# EAGLE design MarioCube_v1.1 (EAGLE 6.2)
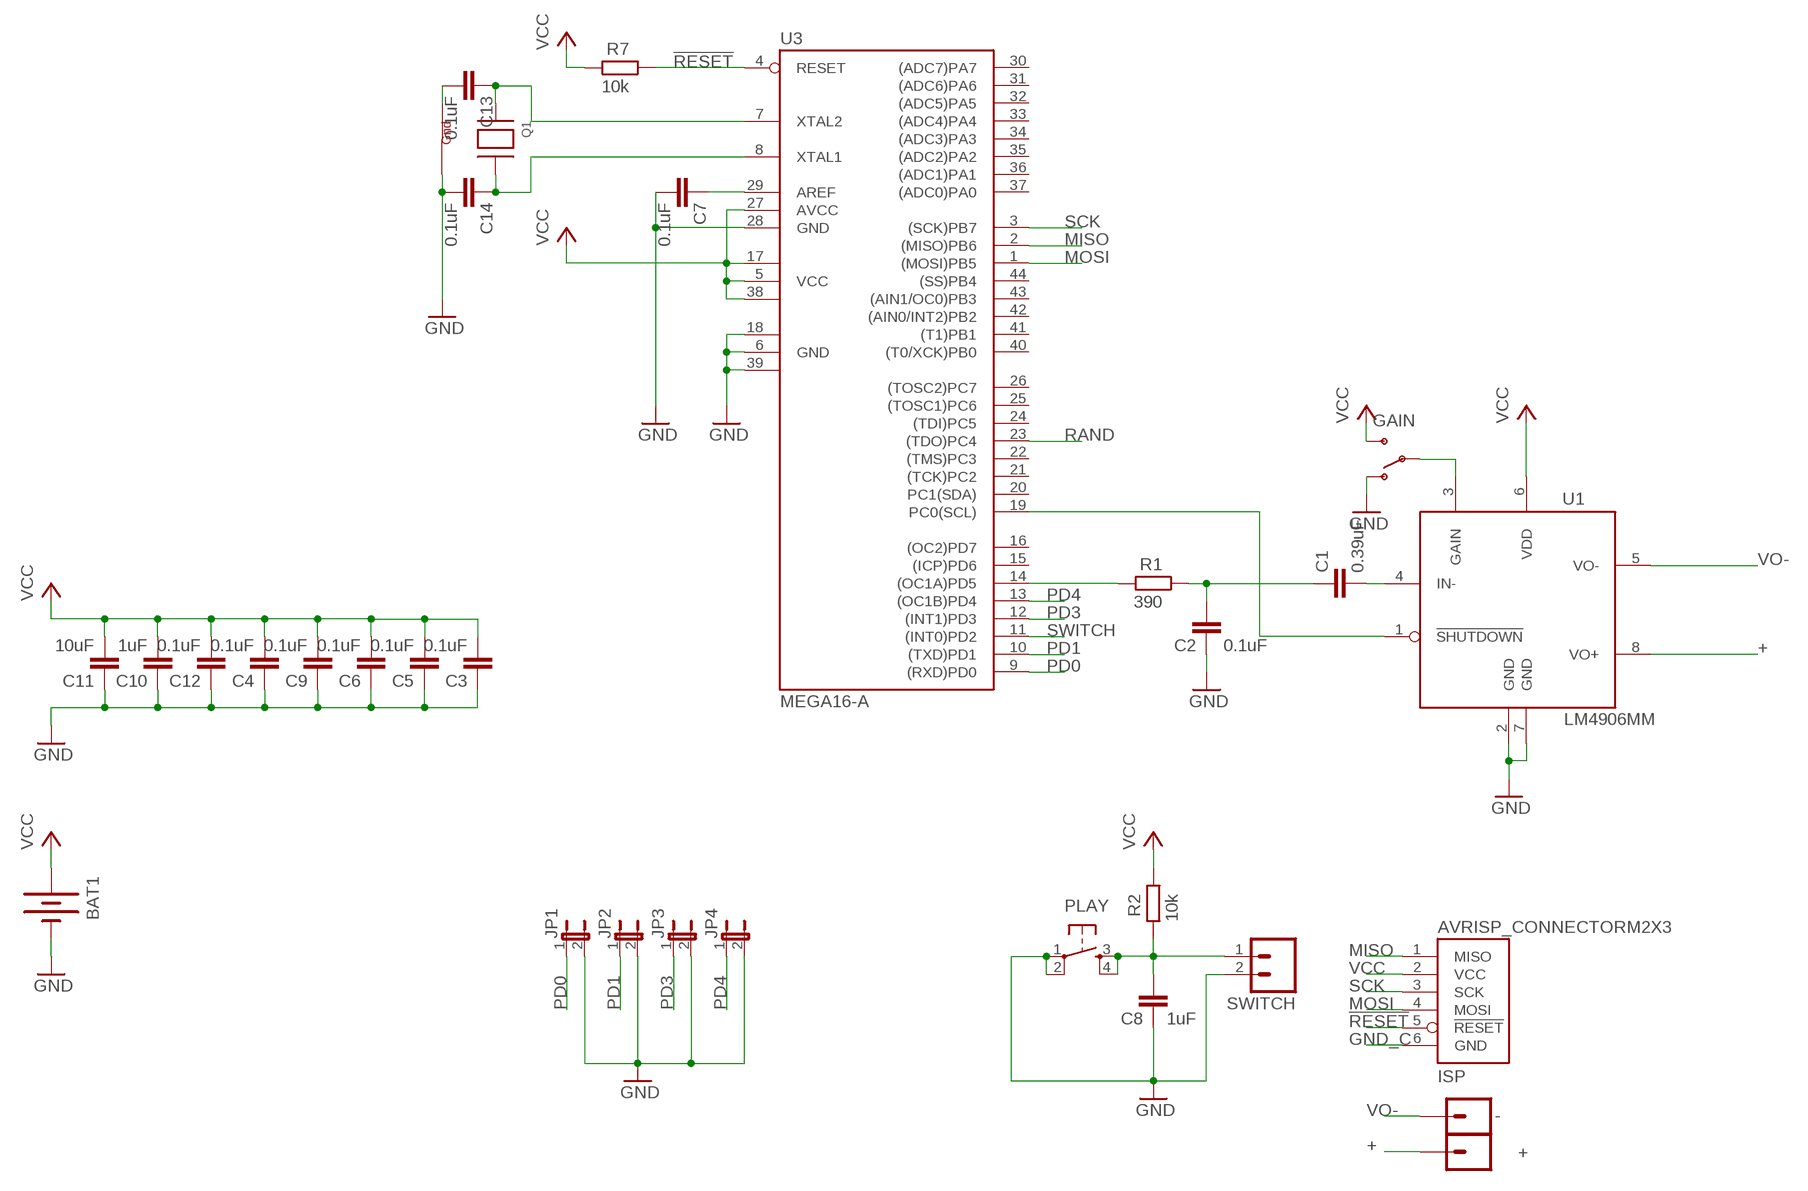
[diagram p0: schematic, sheet 1]

## Parts
+  M01OFFSET  [1X01_OFFSET]
-  M01OFFSET  [1X01_OFFSET]
BAT1  BATTERY2XAAA-2468  [BATTERY_HOLDER_2468]
C1  0.39uF  C-EUC0603K  [C0603K]
C2  0.1uF  C-EUC0603K  [C0603K]
C3  0.1uF  C-EUC0603K  [C0603K]
C4  0.1uF  C-EUC0603K  [C0603K]
C5  0.1uF  C-EUC0603K  [C0603K]
C6  0.1uF  C-EUC0603K  [C0603K]
C7  0.1uF  C-EUC0603K  [C0603K]
C8  1uF  C-EUC0603K  [C0603K]
C9  0.1uF  C-EUC0603K  [C0603K]
C10  1uF  C-EUC0603K  [C0603K]
C11  10uF  C-EUC0603K  [C0603K]
C12  0.1uF  C-EUC0603K  [C0603K]
C13  0.1uF  C-EUC0603K  [C0603K]
C14  0.1uF  C-EUC0603K  [C0603K]
GAIN  SWITCH-SPSTSMD  [AYZ0202]
ISP  AVRISP_CONNECTORM2X3  [2X3]
JP1  JUMPER-2SMD-NO  [SJ_2S-NO]
JP2  JUMPER-2SMD-NO  [SJ_2S-NO]
JP3  JUMPER-2SMD-NO  [SJ_2S-NO]
JP4  JUMPER-2SMD-NO  [SJ_2S-NO]
PLAY  TAC_SWITCHSMD  [TACTILE_SWITCH_SMD]
Q1  XTAL-4-3225  [NX3225]
R1  390  R-EU_R0603  [R0603]
R2  10k  R-EU_R0603  [R0603]
R7  10k  R-EU_R0603  [R0603]
SWITCH  M02LOCK  [1X02_LOCK]
U1  LM4906MM  [MSOP8]
U3  MEGA16-A  [TQFP44]

## Nets
!RESET: ISP.5(!RESET) R7.1 U3.4(RESET)
+: +.1 U1.8(VO+)
GND_C: BAT1.GND@1(-) C2.1 C3.1 C4.1 C5.1 C6.1 C7.2 C8.1 C9.1 C10.1 C11.1 C12.1 C13.2 C14.2 GAIN.1(O) ISP.6(GND) JP1.2 JP2.2 JP3.2 JP4.2 PLAY.1 PLAY.2 Q1.2(G2) Q1.4(G1) SWITCH.2 U1.2(GND) U1.7(GND) U3.6(GND) U3.18(GND1) U3.28(GND) U3.39(GND2) ; supply symbol labelled GND
MISO: ISP.1(MISO) U3.2((MISO)PB6)
MOSI: ISP.4(MOSI) U3.1((MOSI)PB5)
N$1: C1.2 U1.4(IN-)
N$2: U1.1(!SHUTDOWN) U3.19(PC0(SCL))
N$3: C1.1 C2.2 R1.1
N$4: GAIN.2(P) U1.3(GAIN)
N$5: R1.2 U3.14((OC1A)PD5)
N$6: C14.1 Q1.3(X2) U3.8(XTAL1)
N$7: C13.1 Q1.1(X1) U3.7(XTAL2)
N$8: C7.1 U3.29(AREF)
PD0: JP1.1 U3.9((RXD)PD0)
PD1: JP2.1 U3.10((TXD)PD1)
PD3: JP3.1 U3.12((INT1)PD3)
PD4: JP4.1 U3.13((OC1B)PD4)
RAND: U3.23((TDO)PC4)
SCK: ISP.3(SCK) U3.3((SCK)PB7)
SWITCH: C8.2 PLAY.3 PLAY.4 R2.2 SWITCH.1 U3.11((INT0)PD2)
VCC: BAT1.PWR@1(+) C3.2 C4.2 C5.2 C6.2 C9.2 C10.2 C11.2 C12.2 GAIN.3(S) ISP.2(VCC) R2.1 R7.2 U1.6(VDD) U3.5(VCC) U3.17(VCC1) U3.27(AVCC) U3.38(VCC2)
VO-: -.1 U1.5(VO-)
Unconnected: U3.15((ICP)PD6) U3.16((OC2)PD7) U3.20(PC1(SDA)) U3.21((TCK)PC2) U3.22((TMS)PC3) U3.24((TDI)PC5) U3.25((TOSC1)PC6) U3.26((TOSC2)PC7) U3.30((ADC7)PA7) U3.31((ADC6)PA6) U3.32((ADC5)PA5) U3.33((ADC4)PA4) U3.34((ADC3)PA3) U3.35((ADC2)PA2) U3.36((ADC1)PA1) U3.37((ADC0)PA0) U3.40((T0/XCK)PB0) U3.41((T1)PB1) U3.42((AIN0/INT2)PB2) U3.43((AIN1/OC0)PB3) U3.44((SS)PB4)

## Library data of the parts
+ - = SparkFun:M01: Header 1 Standard 1-pin 0.1" header. Use with straight break away headers (SKU : PRT-00116), right angle break away headers (PRT-00553), swiss pins (PRT-00743), machine pins (PRT-00117), and female headers (PRT-00115).
BAT1 = V2_:BATTERY: Battery Holders Various common sizes : AA, AAA, 20mm coin cell and 12mm coin cell.; DIGIKEY: BK-912-CT-ND
C1-C14 = rcl:C-EU: CAPACITOR, European symbol
GAIN = SparkFun:SWITCH-SPST: SPST Switch Simple slide switch. Spark Fun Electronics SKU : COM-00102; DIGIKEY: 401-2013-1-ND
ISP = V2_:AVRISP_CONNECTOR
JP1-JP4 = SparkFun:JUMPER-2: Jumper Basic 0.1" spaced jumper. Use with breakaway headers.
PLAY = SparkFun:TAC_SWITCH: Momentary Switch Button commonly used for reset or general input. Spark Fun Electronics SKU : COM-00097; DIGIKEY: CKN9104CT-ND
Q1 = adafruit:XTAL-4: Classic 4-pin 3.2 x 2.5mm crystal
R1 R2 R7 = rcl:R-EU_: RESISTOR, European symbol
SWITCH = SparkFun:M02: Header 2 Standard 2-pin 0.1" header. Use with straight break away headers (SKU : PRT-00116), right angle break away headers (PRT-00553), swiss pins (PRT-00743), machine pins (PRT-00117), and female headers (PRT-00115). Molex polarized connector foot print use with SKU : PRT-08233 with associated crimp pins and housings.
U1 = V2_:LM4906: LM4906 Boomer 1W, Bypass-Capacitor-less Audio Amplifier with Internal Selectable Gain
U3 = atmel:MEGA16: MICROCONTROLLER 16 Kbytes FLASH 1 kbytes SRAM 512 bytes EEPROM USART 8-channel 10 bit ADC Source: avr.lbr; MPN: ATMEGA16-16AU; OC_FARNELL: 9171134; OC_NEWARK: 96K6515

## Board
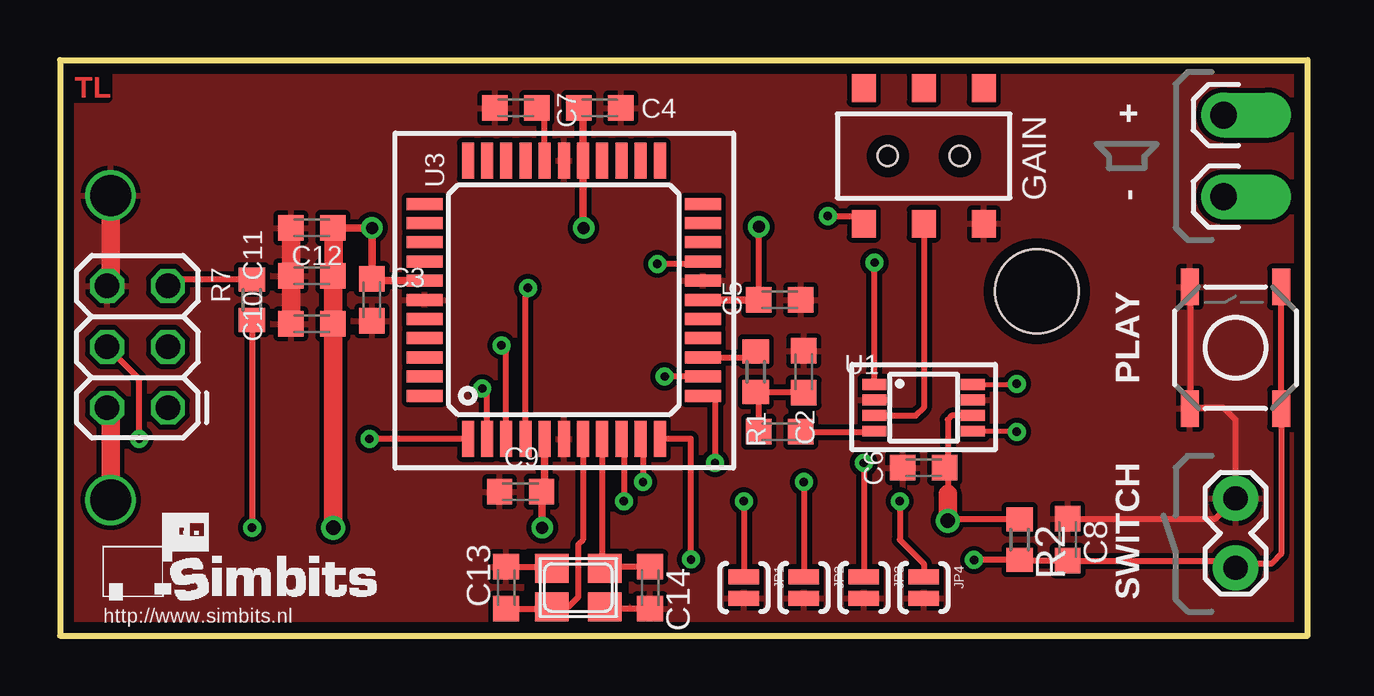
[diagram p1: board, top side]
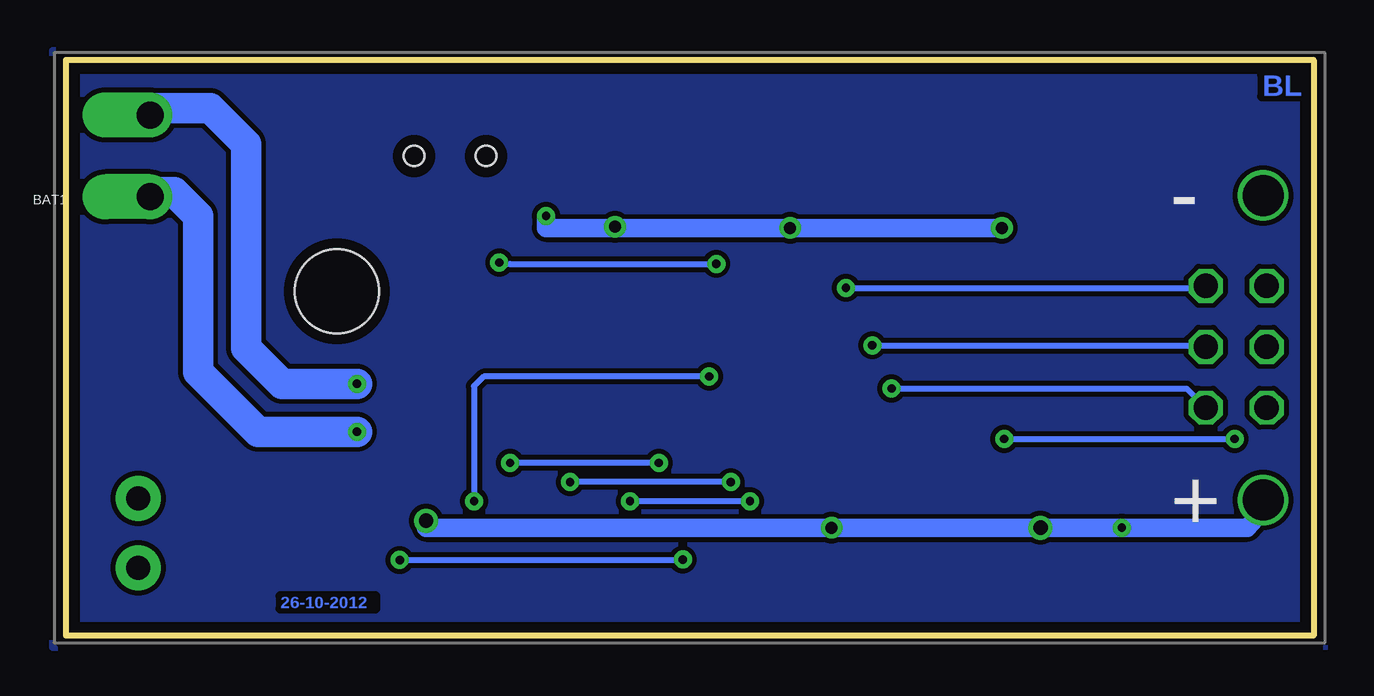
[diagram p2: board, bottom side, seen from below]

Size 52 x 24 mm. Coordinates in mm from the lower left corner, seen from the top.
Outline: 0,0 52,0 52,24 0,24 0,0
Copper layers (1*16): Top 0.018mm / dielectric 1.55mm / Bottom 0.018mm
Design rules: minimum track width 0.15mm, minimum drill 0.25mm, track to track 0.15mm, track to pad 0.15mm, pad to pad 0.15mm, via to via 0.15mm, smd to smd 0.15mm, copper to edge 0.45mm, drill to drill 0.3mm, minimum pad ring 0.2mm, minimum via ring 0.2mm, stop-mask expansion 0.1mm, vias tented up to drill 0mil, thermal gap 0.2mm

### Footprints (pad centres in the part's own frame; a part is rotated, then mirrored left to right if it is on the bottom)
1X01_OFFSET = drill 1.118 pad 1.88 offset: 1 0,0
BATTERY_HOLDER_2468 = drill 1.702: GND@1 50.39,6.35; PWR@1 50.39,-6.35 | hole 3.5: 11.78,2.35
C0603K = smd 1.05 x 1.08: 1 -0.875,0; 2 0.875,0
AYZ0202 = smd 1 x 1.15: 1 -2.5,2.825; 2 0,2.825; 3 2.5,2.825; 4 -2.5,-2.825; 5 0,-2.825; 6 2.5,-2.825 | hole 0.85: 1.5,0; -1.5,0
2X3 = drill 1.016 octagon: 1 0,0; 2 0,2.54; 3 2.54,0; 4 2.54,2.54; 5 5.08,0; 6 5.08,2.54
SJ_2S-NO = smd 0.635 x 1.27: 1 -0.45,0; 2 0.45,0
TACTILE_SWITCH_SMD = smd 1.524 x 0.762: 1 -2.54,1.905; 2 2.54,1.905; 3 -2.54,-1.905; 4 2.54,-1.905
NX3225 = smd 1.4 x 1.2: 1 -1.1,-0.8; 2 1.1,-0.8; 3 1.1,0.8; 4 -1.1,0.8
R0603 = smd 1 x 1.1: 1 -0.85,0; 2 0.85,0
1X02_LOCK = drill 1.016 pad 1.88: 1 -0.178,0; 2 2.718,0
MSOP8 = smd 0.45 x 1: 1 -0.975,-2.05; 2 -0.325,-2.05; 3 0.325,-2.05; 4 0.975,-2.05; 5 0.975,2.05; 6 0.325,2.05; 7 -0.325,2.05; 8 -0.975,2.05
TQFP44 = smd 1.5 x 0.5: 1 -5.8,4; 2 -5.8,3.2; 3 -5.8,2.4; 4 -5.8,1.6; 5 -5.8,0.8; 6 -5.8,0; 7 -5.8,-0.8; 8 -5.8,-1.6; 9 -5.8,-2.4; 10 -5.8,-3.2; 11 -5.8,-4; 23 5.8,-4; 24 5.8,-3.2; 25 5.8,-2.4; 26 5.8,-1.6; 27 5.8,-0.8; 28 5.8,0; 29 5.8,0.8; 30 5.8,1.6; 31 5.8,2.4; 32 5.8,3.2; 33 5.8,4 | smd 0.5 x 1.5: 12 -4,-5.8; 13 -3.2,-5.8; 14 -2.4,-5.8; 15 -1.6,-5.8; 16 -0.8,-5.8; 17 0,-5.8; 18 0.8,-5.8; 19 1.6,-5.8; 20 2.4,-5.8; 21 3.2,-5.8; 22 4,-5.8; 34 4,5.8; 35 3.2,5.8; 36 2.4,5.8; 37 1.6,5.8; 38 0.8,5.8; 39 0,5.8; 40 -0.8,5.8; 41 -1.6,5.8; 42 -2.4,5.8; 43 -3.2,5.8; 44 -4,5.8

### Placement (x,y rotation side)
+  48.5,21.7 270 top
-  48.5,18.3 270 top
BAT1  52.5,12 0 bottom
C1  30,8.5 0 top
C2  31,11 270 top
C3  13,14 90 top
C4  22.5,22 180 top
C5  30,14 180 top
C6  36,7 0 top
C7  19,22 180 top
C8  42,4 270 top
C9  19.2,6 0 top
C10  10.5,13 0 top
C11  10.5,15 0 top
C12  10.5,17 0 top
C13  18.6,2 90 top
C14  24.6,2 270 top
GAIN  36,20 180 top
ISP  4.5,9.5 90 top
JP1  28.5,2 270 top
JP2  31,2 270 top
JP3  33.5,2 270 top
JP4  36,2 270 top
PLAY  49,12 90 top
Q1  21.6,2 0 top
R1  29,11 90 top
R2  40,4 270 top
R7  8,14 270 top
SWITCH  49,3 90 top
U1  36,9.5 270 top
U3  21,14 90 top

### Tracks (layer width: path | path; a pad name or v marks a point on that pad's centre or on a via)
!RESET  (via drill 0.35)
  Top 0.254: R7.1 4.77,14.85 ISP.5 | U3.4 19.4,14.1 v19.5,14.5
  Bottom 0.254: v19.5,14.5 4.92,14.5 ISP.5
+  (via drill 0.35)
  Top 0.203: U1.8 39.5,10.47 v39.88,10.5
  Bottom 1.27: v39.88,10.5 43,10.5 44.5,12 44.5,20.5 46,22 48.2,22 +.1
GND
  pour Bottom (isolate 0.203, rank 2): 52.6,24.4 52.6,-0.5 -0.5,-0.5 -0.5,24.4
GND_C
  Top 0.254: 47.13,9.5 48.5,9.5 49,9 SWITCH.2 48.16,4.88 C8.1 | 47.13,9.5 PLAY.1 | C10.1 9.5,13 | 47.13,9.5 47.13,14.5 PLAY.2 | C13.2 20.43,2.88 Q1.4 | C14.2 22.77,1.12 Q1.2
  Top 0.762: C12.1 C11.1 C10.1 | BAT1.GND@1 2.11,14.73 ISP.6
  pour Top (isolate 0.203, rank 2): -1,25 53,25 53,-1 52.5,-0.5 -0.5,-0.5 -1,0
MISO  (via drill 0.35)
  Top 0.254: U3.2 17.8,10.1 v17.6,10.3
  Bottom 0.254: v17.6,10.3 5.3,10.3 ISP.1
MOSI  (via drill 0.35)
  Top 0.254: U3.1 v12.9,8.2 | v3.3,8.2 3.3,10.7 ISP.4
  Bottom 0.254: v12.9,8.2 v3.3,8.2
N$1
  Top 0.254: C1.2 33.92,8.5 U1.4
N$2  (via drill 0.35)
  Top 0.254: U1.1 v33.95,15.55 | U3.19 26.8,15.5 v24.9,15.5
  Bottom 0.254: v33.95,15.55 33.5,15.5 v24.9,15.5
N$3
  Top 0.254: C1.1 29.12,10.03 R1.1 30.98,10.15 C2.2
N$4
  Top 0.254: GAIN.2 36,9.5 35.67,9.18 U1.3
N$5
  Top 0.254: U3.14 28.75,11.6 R1.2
N$6
  Top 0.254: U3.8 22.6,2.9 Q1.3 22.77,2.88 C14.1
N$7
  Top 0.254: U3.7 21.8,4 21.6,3.8 21.6,1.6 21.2,1.2 Q1.1 20.43,1.12 C13.1
N$8
  Top 0.254: U3.29 20.2,21.68 C7.1
N$9
  cutout Top: 19.5,3.5 19.4,0.3 23.6,0.3 23.6,3.5
PD0  (via drill 0.35)
  Top 0.254: U3.9 23.5,8.2 v23.5,5.6 | v28.5,5.6 JP1.1
  Bottom 0.254: v23.5,5.6 v28.5,5.6
PD1  (via drill 0.35)
  Top 0.254: U3.10 24.3,8.2 v24.3,6.4 | v31,6.4 JP2.1
  Bottom 0.254: v24.3,6.4 v31,6.4
PD3  (via drill 0.35)
  Top 0.254: U3.12 27.3,10 v27.3,7.2 | v33.5,7.2 JP3.1
  Bottom 0.254: v27.3,7.2 v33.5,7.2
PD4  (via drill 0.35)
  Top 0.254: U3.13 v25.2,10.8 | v35,5.6 35,4 36,3 JP4.1
  Bottom 0.254: v25.2,10.8 34.6,10.8 35,10.4 v35,5.6
SCK  (via drill 0.35)
  Top 0.254: U3.3 18.6,11.9 v18.4,12.1
  Bottom 0.254: v18.4,12.1 4.56,12.1 ISP.3
SWITCH  (via drill 0.35)
  Top 0.254: PLAY.4 PLAY.3 50.91,3.4 50.5,3 49.18,3 SWITCH.1 48.7,3.12 C8.2 40.02,3.12 R2.2 v38.1,3.15 | v26.3,3.17 26.3,8.2 U3.11
  Bottom 0.254: v38.1,3.15 26.35,3.15 v26.3,3.17
VCC  (via drill 0.35, 0.5, 0.6)
  Top 0.254: U1.6 37.17,9.18 37,9 37,7.12 | 37,7.12 C6.2 | C3.2 13,15 13.2,14.8 | 11.5,14.88 C11.2 11.38,14.62 11.4,15 | 11.4,16.88 C12.2 | 21.8,21.82 C4.2 | 37,7.12 37,5.9 | R2.1 37.15,4.85 v37,4.79 | 21.8,17.02 v21.82,17 | C5.2 v29.12,17.05 | 33.3,17.38 GAIN.3 33.17,17.5 v32,17.5 | R7.2 v8,4.5
  Top 0.305: U3.17 C5.2 | 13.2,14.8 U3.38 | 21.8,21.82 U3.27 21.8,17.02 | C3.2 v13,17 C12.2 | U3.5 20.2,6.5 19.8,6.1 C9.2 20.1,6.08 v20.1,4.5
  Top 0.406: C10.2
  Top 0.762: 37,5.9 v37,4.79 | BAT1.PWR@1 2.11,9.35 ISP.2 | 11.5,12.88 C10.2 C11.2 | 11.4,15 11.4,16.98 C12.2 | C10.2 v11.39,4.5
  Bottom 0.254: v29.12,17.05 32,17
  Bottom 0.762: v37,4.79 37,4.5 v20.1,4.5 v11.39,4.5 v8,4.5 2.76,4.5 2.13,5.22 2.13,5.63 BAT1.PWR@1 | v13,17 v21.82,17 32,17 v32,17.5
VO-  (via drill 0.35)
  Top 0.203: U1.5 39.48,8.53 v39.88,8.5
  Bottom 0.203: 48.3,18.5 -.1
  Bottom 1.27: v39.88,8.5 44,8.5 46.5,11 46.5,17.5 47.5,18.5 48.3,18.5

### Text on the board
Top: TL
Bottom: BL | 26-10-2012
Document: Hammond 1551PTBU
_tsilk: http://www.simbits.nl
_bsilk: Sound module | Rev. 1.1